# EAGLE schematic lab2 (EAGLE 8.3.1)
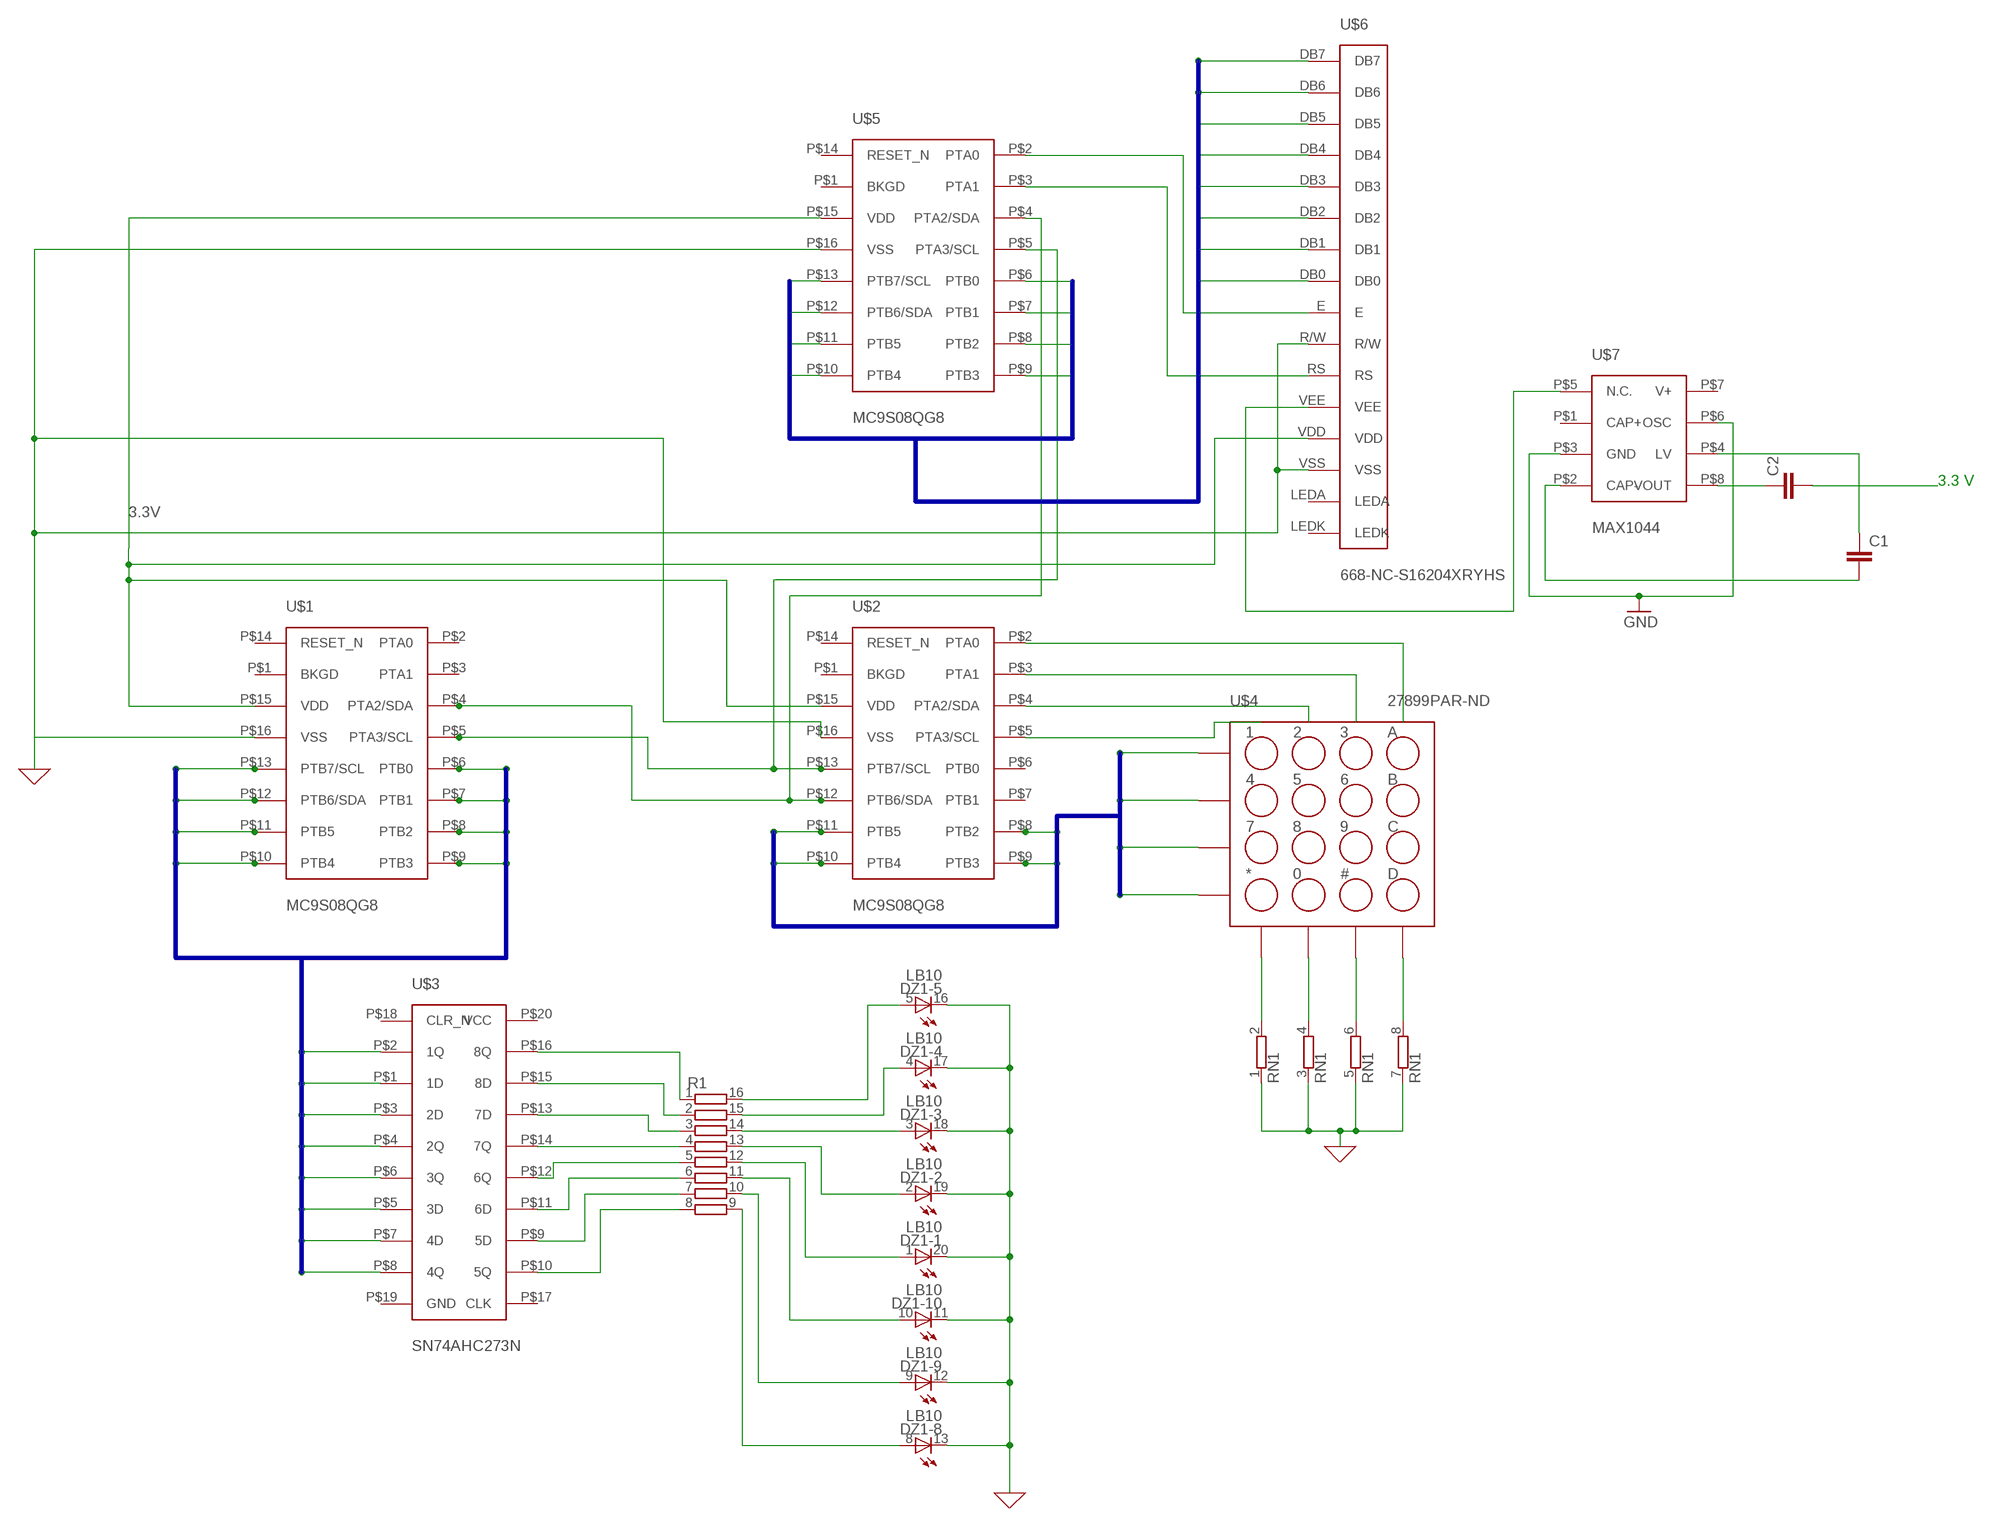
[diagram p0: schematic, sheet 1]

## Parts
C1  C2,5-3  [C2.5-3]
C2  C2,5-3  [C2.5-3]
DZ1  LB10  [LB10]
R1  2QSP16-8  [2QSP16]
RN1  E4RP  [SIL8]
U$1  MC9S08QG8  [MC9S08QG8]
U$2  MC9S08QG8  [MC9S08QG8]
U$3  SN74AHC273N  [SN74AHC273N]
U$4  27899PAR-ND  [27899PAR-ND]
U$5  MC9S08QG8  [MC9S08QG8]
U$6  668-NC-S16204XRYHS  [668-NC-S16204XRYHS]
U$7  MAX1044  [MAX1044]

## Nets
0: DZ1.11(-10:C) DZ1.12(-9:C) DZ1.13(-8:C) DZ1.16(-5:C) DZ1.17(-4:C) DZ1.18(-3:C) DZ1.19(-2:C) DZ1.20(-1:C) RN1.1 RN1.3 RN1.5 RN1.7 U$1.P$16(VSS) U$2.P$16(VSS) U$5.P$16(VSS) U$6.R/W U$6.VSS ; supply symbol labelled GND
3.3V: U$1.P$15(VDD) U$2.P$15(VDD) U$5.P$15(VDD) U$6.VDD
B$3: U$6.DB0 U$6.DB1 U$6.DB2 U$6.DB3 U$6.DB4 U$6.DB5 U$6.DB6 U$6.DB7
GND: U$7.P$3(GND) U$7.P$6(OSC)
N$1: U$1.P$13(PTB7/SCL)
N$2: U$1.P$12(PTB6/SDA)
N$3: U$1.P$11(PTB5)
N$4: U$1.P$10(PTB4)
N$5: U$1.P$9(PTB3)
N$6: U$1.P$8(PTB2)
N$7: U$1.P$7(PTB1)
N$8: U$1.P$6(PTB0)
N$9: R1.1 U$3.P$16(8Q)
N$10: U$3.P$2(1Q)
N$11: U$3.P$1(1D)
N$12: U$3.P$3(2D)
N$13: U$3.P$4(2Q)
N$14: U$3.P$6(3Q)
N$15: U$3.P$5(3D)
N$16: U$3.P$7(4D)
N$17: U$3.P$8(4Q)
N$18: R1.2 U$3.P$15(8D)
N$19: R1.3 U$3.P$13(7D)
N$20: R1.4 U$3.P$14(7Q)
N$21: R1.5 U$3.P$12(6Q)
N$22: R1.6 U$3.P$11(6D)
N$23: R1.7 U$3.P$9(5D)
N$24: R1.8 U$3.P$10(5Q)
N$25: DZ1.8(-8:A) R1.9
N$26: DZ1.9(-9:A) R1.10
N$27: DZ1.10(-10:A) R1.11
N$28: DZ1.1(-1:A) R1.12
N$29: DZ1.2(-2:A) R1.13
N$30: DZ1.3(-3:A) R1.14
N$31: DZ1.4(-4:A) R1.15
N$32: DZ1.5(-5:A) R1.16
N$33: U$1.P$4(PTA2/SDA) U$2.P$12(PTB6/SDA) U$5.P$4(PTA2/SDA)
N$34: U$1.P$5(PTA3/SCL) U$2.P$13(PTB7/SCL) U$5.P$5(PTA3/SCL)
N$35: U$2.P$11(PTB5)
N$36: U$2.P$10(PTB4)
N$37: U$2.P$8(PTB2)
N$38: U$2.P$9(PTB3)
N$39: U$4.P$4
N$40: U$4.P$3
N$41: U$4.P$2
N$42: U$4.P$1
N$43: RN1.2 U$4.P$8
N$44: RN1.4 U$4.P$7
N$45: RN1.6 U$4.P$6
N$46: RN1.8 U$4.P$5
N$47: U$2.P$2(PTA0)
N$48: U$2.P$3(PTA1)
N$49: U$2.P$4(PTA2/SDA)
N$50: U$2.P$5(PTA3/SCL)
N$51: C2.1 U$7.P$8(VOUT)
N$52: C2.2
N$53: U$5.P$13(PTB7/SCL)
N$54: U$5.P$12(PTB6/SDA)
N$55: U$5.P$11(PTB5)
N$56: U$5.P$10(PTB4)
N$57: U$5.P$9(PTB3)
N$58: U$5.P$8(PTB2)
N$59: U$5.P$7(PTB1)
N$60: U$5.P$6(PTB0)
N$61: U$5.P$2(PTA0) U$6.E
N$62: U$5.P$3(PTA1) U$6.RS
N$63: U$6.VEE U$7.P$5(N.C.)
N$66: C1.2 U$7.P$2(CAP-)
N$67: C1.1 U$7.P$4(LV)
Unconnected: DZ1.6(-6:A) DZ1.7(-7:A) DZ1.14(-7:C) DZ1.15(-6:C) U$1.P$1(BKGD) U$1.P$2(PTA0) U$1.P$3(PTA1) U$1.P$14(RESET_N) U$2.P$1(BKGD) U$2.P$6(PTB0) U$2.P$7(PTB1) U$2.P$14(RESET_N) U$3.P$17(CLK) U$3.P$18(CLR_N) U$3.P$19(GND) U$3.P$20(VCC) U$5.P$1(BKGD) U$5.P$14(RESET_N) U$6.LEDA U$6.LEDK U$7.P$1(CAP+) U$7.P$7(V+)

## Buses
B$1
B$2
B$3

## Notes on the sheet
- 3.3 V

## Library data of the parts
C1 C2 = capacitor-wima:C: CAPACITOR naming: grid - package width
DZ1 = led:LB10: LED BLOCK 10-LED bar graph, DIL, Siemens
R1 = resistor-bourns:2QSP16-8: BOURNS RESISTOR NETWORK; OC_FARNELL: unknown; OC_NEWARK: unknown
RN1 = resistor-sil:E4RP: SIL RESISTOR; OC_FARNELL: unknown; OC_NEWARK: unknown
U$1 U$2 U$5 = EELE_465:MC9S08QG8
U$3 = EELE_465:SN74AHC273N
U$4 = EELE_465:27899PAR-ND
U$6 = EELE_465:668-NC-S16204XRYHS
U$7 = EELE_465:MAX1044